# EAGLE design Magician_encoder (EAGLE 6.5.0)
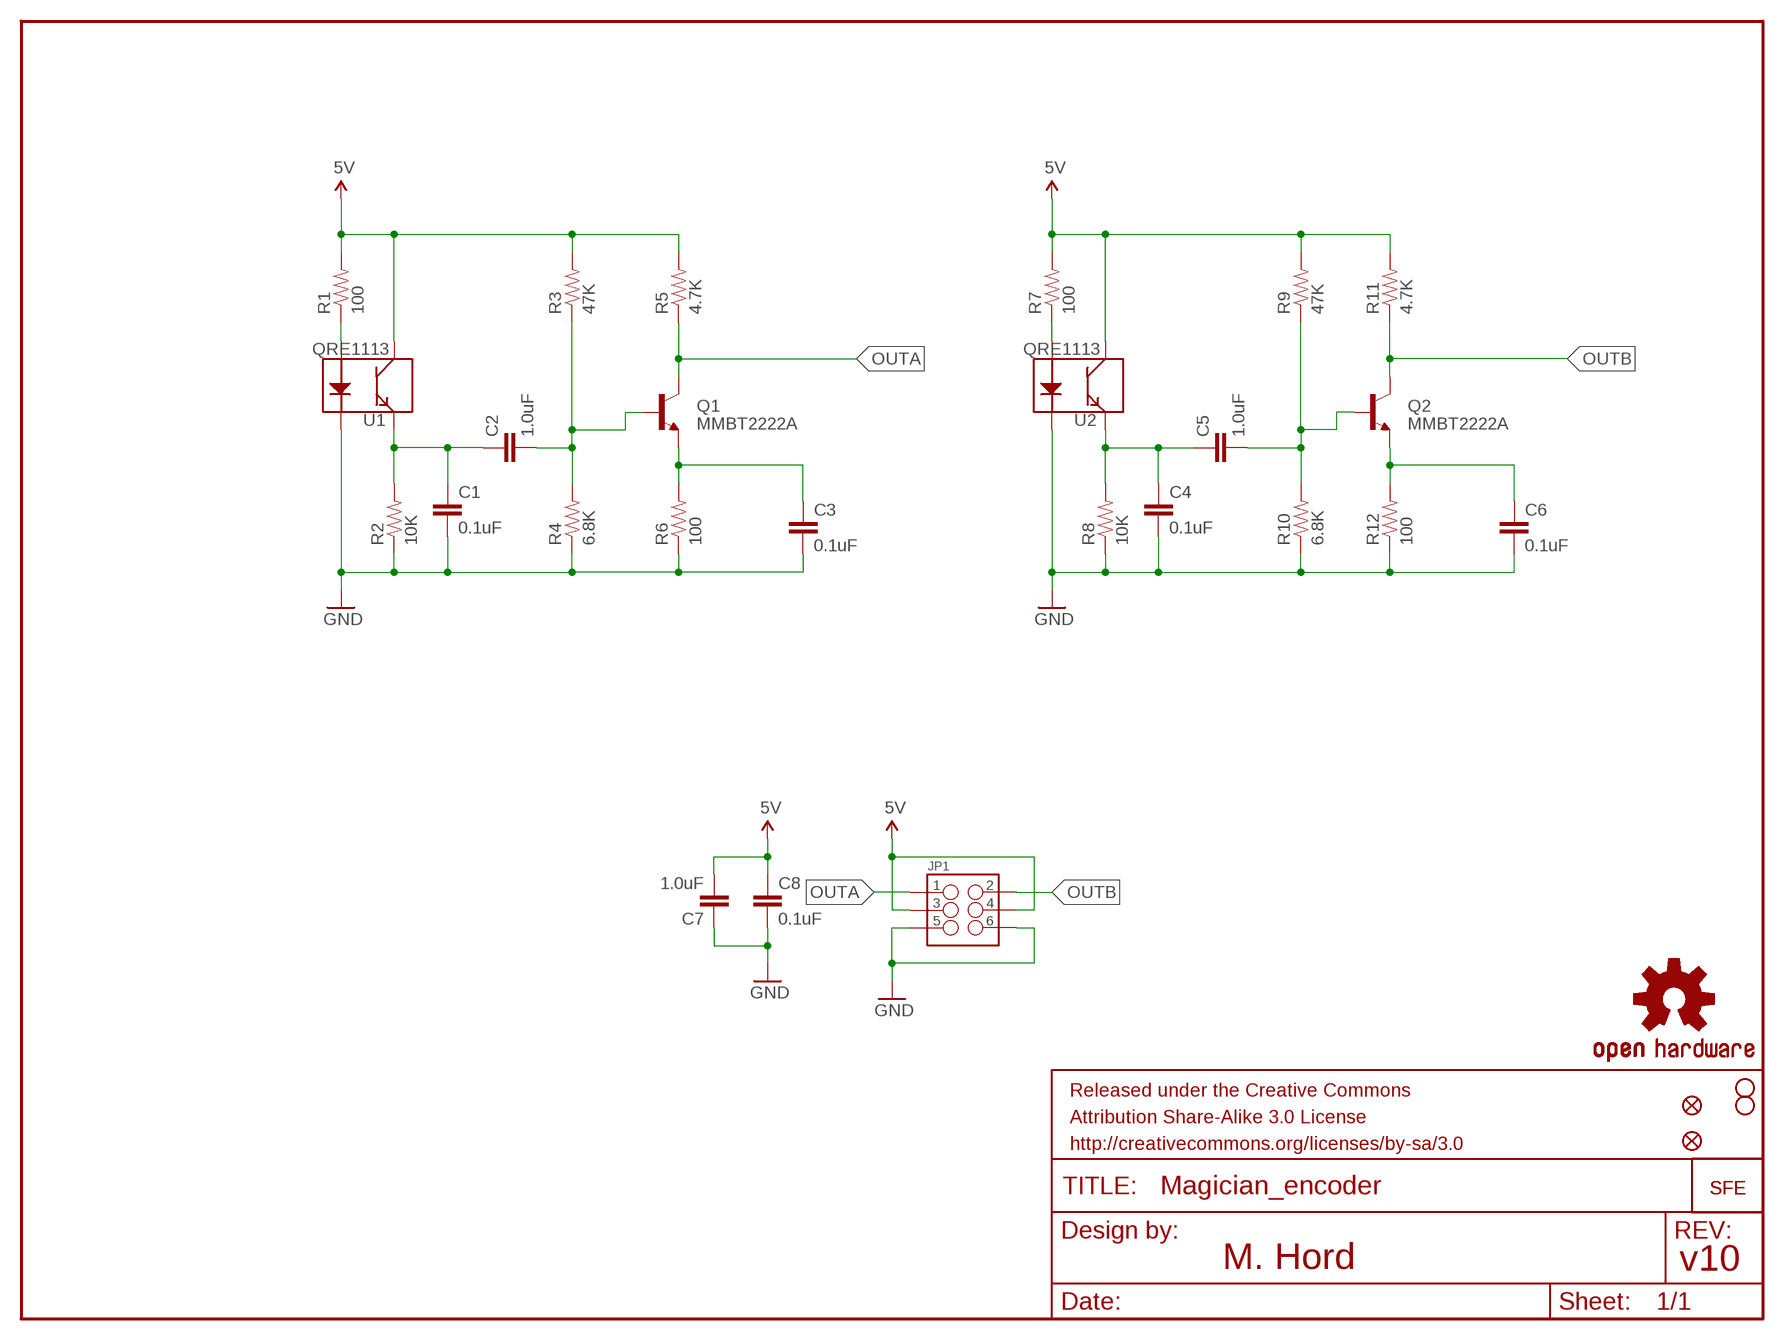
[diagram p0: schematic, sheet 1]

## Parts
C1  0.1uF  0.1UF-25V(+80/-20%)(0603)  [0603-CAP]
C2  1.0uF  1.0UF-16V-10%(0603)  [0603-CAP]
C3  0.1uF  0.1UF-25V(+80/-20%)(0603)  [0603-CAP]
C4  0.1uF  0.1UF-25V(+80/-20%)(0603)  [0603-CAP]
C5  1.0uF  1.0UF-16V-10%(0603)  [0603-CAP]
C6  0.1uF  0.1UF-25V(+80/-20%)(0603)  [0603-CAP]
C7  1.0uF  1.0UF-16V-10%(0603)  [0603-CAP]
C8  0.1uF  0.1UF-25V(+80/-20%)(0603)  [0603-CAP]
FID1  FIDUCIALUFIDUCIAL  [MICRO-FIDUCIAL]
FID2  FIDUCIALUFIDUCIAL  [MICRO-FIDUCIAL]
FRAME1  FRAME-LETTER  [CREATIVE_COMMONS]
JP1  M03X22X3_SILK_SM  [2X3]
LOGO1  LOGO-SFESK  [SFE-LOGO-FLAME]
LOGO3  OSHW-LOGOS  [OSHW-LOGO-S]
LOGO4  LOGO-SFENEW  [SFE-NEW-WEBLOGO]
Q1  MMBT2222A  TRANSISTOR_NPNMMBT2222A  [SOT23]
Q2  MMBT2222A  TRANSISTOR_NPNMMBT2222A  [SOT23]
R1  100  100OHM1/10W1%(0603)  [0603-RES]
R2  10K  10KOHM1/10W1%(0603)0603  [0603-RES]
R3  47K  47KOHM1/10W1%(0603)  [0603-RES]
R4  6.8K  10KOHM1/10W1%(0603)0603  [0603-RES]
R5  4.7K  10KOHM1/10W1%(0603)0603  [0603-RES]
R6  100  1KOHM1/10W1%(0603)  [0603-RES]
R7  100  100OHM1/10W1%(0603)  [0603-RES]
R8  10K  10KOHM1/10W1%(0603)0603  [0603-RES]
R9  47K  47KOHM1/10W1%(0603)  [0603-RES]
R10  6.8K  10KOHM1/10W1%(0603)0603  [0603-RES]
R11  4.7K  10KOHM1/10W1%(0603)0603  [0603-RES]
R12  100  1KOHM1/10W1%(0603)  [0603-RES]
STANDOFF1  STAND-OFF  [STAND-OFF]
STANDOFF2  STAND-OFF  [STAND-OFF]
U1  QRE1113  [QRE1113]
U2  QRE1113  [QRE1113]

## Nets
5V: C7.2 C8.1 JP1.3 JP1.4 R1.2 R3.2 R5.2 R7.2 R9.2 R11.2 U1.3(C) U2.3(C)
GND: C1.2 C3.2 C4.2 C6.2 C7.1 C8.2 JP1.5 JP1.6 R2.1 R4.1 R6.1 R8.1 R10.1 R12.1 U1.2(K) U2.2(K)
N$1: C1.1 C2.1 R2.2 U1.4(E)
N$2: C2.2 Q1.1(B) R3.1 R4.2
N$3: C3.1 Q1.2(E) R6.2
N$5: R1.1 U1.1(A)
N$7: C6.1 Q2.2(E) R12.2
N$8: C4.1 C5.1 R8.2 U2.4(E)
N$9: C5.2 Q2.1(B) R9.1 R10.2
N$10: R7.1 U2.1(A)
OUTA: JP1.1 Q1.3(C) R5.1
OUTB: JP1.2 Q2.3(C) R11.1

## Notes on the sheet
- M. Hord | v10

## Library data of the parts
C1 C3 C4 C6 C8 = SparkFun-Capacitors:0.1UF-25V(+80/-20%)(0603): Ceramic Standard decoupling cap CAP-00810; PROD_ID: CAP-00810
C2 C5 C7 = SparkFun-Capacitors:1.0UF-16V-10%(0603): CAP-00868; PROD_ID: CAP-00868
FID1 FID2 = SparkFun-Aesthetics:FIDUCIAL: Fiducial Alignment Points Various fiducial points for machine vision alignment.
FRAME1 = SparkFun-Aesthetics:FRAME-LETTER: Schematic Frame Standard 8.5x11 US Letter frame
JP1 = SparkFun-Connectors:M03X2: 2x3 .1" header. Shrouded, with keying- CONN-10681 SMT- CONN-11415 Pogo pins- HW-11044
LOGO1 LOGO4 = SparkFun-Aesthetics:LOGO-SFE: Spark Fun Electronics PCB Logo This is the standard Spark Fun Electronics PCB logo.
LOGO3 = SparkFun-Aesthetics:OSHW-LOGO: Open Source Hardware Logo This logo indicates the piece of hardware it is found on incorporates a OSHW license and/or adheres to the definition of open source hardware found here: http://freedomdefined.org/OSHW
Q1 Q2 = SparkFun-DiscreteSemi:TRANSISTOR_NPN: Generic NPN BJT MMBT2222A - TRANS-08049 (SOT-23, 1A 40V) MPSA42 - TRANS-09116 (SOT-23, 500mA 300V) MMBT5088LT1G - TRANS-11160 (SOT-23, 50 mA 30V); PROD_ID: TRANS-08049
R1 R7 = SparkFun-Resistors:100OHM1/10W1%(0603): RES-07863; PROD_ID: RES-07863
R2 R8 = SparkFun-Resistors:10KOHM1/10W1%(0603): RES-00824; PROD_ID: RES-00824
R3 R9 = SparkFun-Resistors:47KOHM1/10W1%(0603): RES-07871; PROD_ID: RES-07871
R4 R10 = SparkFun-Resistors:10KOHM1/10W1%(0603): RES-00824; PROD_ID: RES-08597; VALUE: 10K
R5 R11 = SparkFun-Resistors:10KOHM1/10W1%(0603): RES-00824; PROD_ID: RES-07857; VALUE: 10K
R6 R12 = SparkFun-Resistors:1KOHM1/10W1%(0603): RES-07856; PROD_ID: RES-07863; VALUE: 1K
STANDOFF1 STANDOFF2 = SparkFun-Electromechanical:STAND-OFF: #4 Stand Off This is the mechanical footprint for a #4 phillips button head screw. Use the keepout ring to avoid running the screw head into surrounding components. SKU : PRT-00447
U1 U2 = SparkFun-Sensors:QRE1113: Reflective object sensor; PROD_ID: IC-09357

## Board
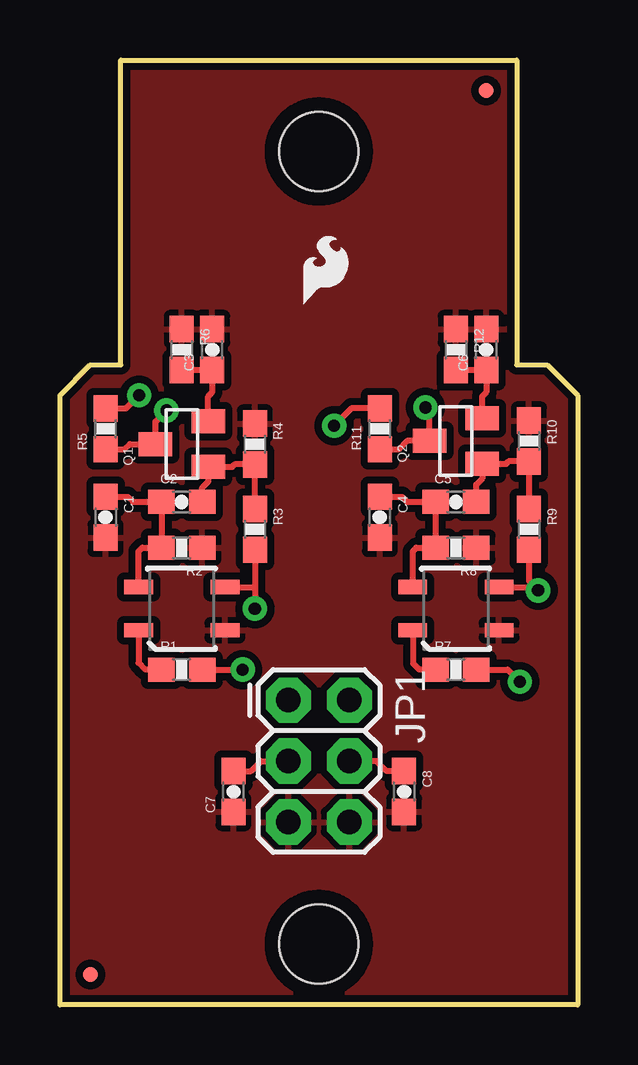
[diagram p1: board, top side]
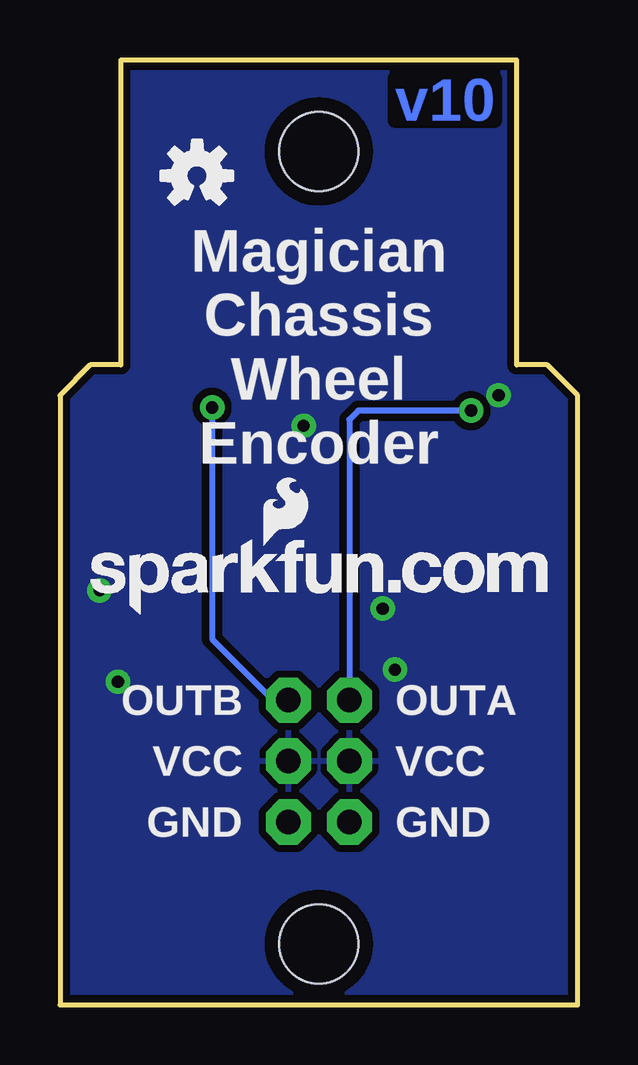
[diagram p2: board, bottom side, seen from below]

Size 21.59 x 39.37 mm. Coordinates in mm from the lower left corner, seen from the top.
Outline: 21.59,25.4 21.59,0 0,0 0,25.4 1.27,26.67 2.54,26.67 2.54,39.37 19.05,39.37 19.05,26.67 20.32,26.67 21.59,25.4
Copper layers (1*16): Top 0.035mm / dielectric 1.5mm / Bottom 0.035mm
Design rules "Sparkfun": minimum track width 8mil, minimum drill 20mil, track to track 8mil, track to pad 8mil, pad to pad 8mil, via to via 8mil, smd to smd 8mil, copper to edge 8mil, drill to drill 8mil, minimum pad ring 12mil, minimum via ring 10mil, stop-mask expansion 4mil, vias tented up to drill 20mil, thermal gap 10mil

### Footprints (pad centres in the part's own frame; a part is rotated, then mirrored left to right if it is on the bottom)
0603-CAP = smd 1.1 x 1: 1 -0.85,0; 2 0.85,0
MICRO-FIDUCIAL = smd 0.635 x 0.635: 1 0,0
2X3 = drill 1.016 pad 1.88 octagon: 1 0,0; 2 0,2.54; 3 2.54,0; 4 2.54,2.54; 5 5.08,0; 6 5.08,2.54
SOT23 = smd 1 x 1.4: 1 -0.95,-1.1; 2 0.95,-1.1; 3 0,1.1
0603-RES = smd 1.1 x 1: 1 -0.85,0; 2 0.85,0
STAND-OFF = hole 3.302: 0,0
QRE1113 = smd 1.2 x 0.6: 1 -1.8,-0.9; 2 1.8,-0.9; 3 1.8,0.9; 4 -1.8,0.9

### Placement (x,y rotation side)
C1  1.91,20.32 270 top
C2  5.08,20.95 0 top
C3  6.35,27.3 90 top
C4  13.34,20.32 270 top
C5  16.51,20.95 0 top
C6  17.78,27.3 90 top
C7  7.24,8.89 90 top
C8  14.35,8.89 270 top
FID1  17.78,38.1 0 top
FID2  1.27,1.27 0 top
FRAME1  -57.15,-10.16 0 top  (outside the outline)
JP1  9.53,12.7 270 top
LOGO1  10.16,29.21 0 top
LOGO3  15.88,34.54 0 bottom
LOGO4  20.32,16.26 0 bottom
Q1  5.08,23.37 90 top
Q2  16.51,23.5 90 top
R1  5.08,13.97 0 top
R2  5.08,19.05 180 top
R3  8.13,19.81 270 top
R4  8.13,23.37 270 top
R5  1.91,24 90 top
R6  5.08,27.3 270 top
R7  16.51,13.97 0 top
R8  16.51,19.05 180 top
R9  19.56,19.81 270 top
R10  19.56,23.5 270 top
R11  13.34,24 90 top
R12  16.51,27.3 270 top
STANDOFF1  10.79,2.54 0 top
STANDOFF2  10.79,35.56 0 top
U1  5.08,16.51 0 top
U2  16.51,16.51 0 top

### Tracks (layer width: path | path; a pad name or v marks a point on that pad's centre or on a via)
5V  (via drill 0.51)
  Top 0.254: R5.2 2.75,24.85 v3.3,25.4 | R1.2 v7.62,13.97 | R3.2 8.13,17.4 | 8.13,17.4 v8.13,16.51 | U1.3 8.12,17.41 8.13,17.4 | R11.2 12.15,24.85 v11.43,24.13 | R7.2 18.67,13.97 v19.18,13.46 | R9.2 19.56,17.65 v19.94,17.27 19.8,17.41 U2.3 | C7.2 7.96,9.74 8.38,10.16 JP1.3 | C8.1 13.63,9.74 13.21,10.16 JP1.4
  pour Bottom (isolate 0.305): 0,39.37 21.59,39.37 21.59,0 0,0
GND
  pour Top (isolate 0.305): 0,39.37 21.59,39.37 21.59,0 0,0
N$1
  Top 0.254: C1.1 2.83,21.17 3.05,20.95 C2.1 R2.2 3.43,19.05 3.28,18.9 U1.4
N$2
  Top 0.254: R3.1 R4.2 7.28,22.52 7.18,22.42 Q1.1 6.18,21.8 6.1,21.72 5.93,21.55 C2.2
N$3
  Top 0.254: R6.2 C3.1 6.35,25.53 6.29,25.46 6.22,25.4 6.18,25.36 Q1.2
N$5
  Top 0.254: R1.1 3.56,13.97 3.28,14.25 U1.1
N$7
  Top 0.254: R12.2 C6.1 17.78,25.53 17.61,25.36 Q2.2
N$8
  Top 0.254: C4.1 14.26,21.17 14.48,20.95 C5.1 R8.2 14.86,19.05 14.71,18.9 U2.4
N$9
  Top 0.254: R9.1 R10.2 18.71,22.64 18.61,22.55 Q2.1 17.61,21.93 17.36,21.68 C5.2 17.36,20.92 17.61,21.17
N$10
  Top 0.254: R7.1 14.99,13.97 14.73,14.22 14.73,15.59 U2.1
OUTA  (via drill 0.51)
  Top 0.254: R5.1 2.71,23.15 2.92,23.37 Q1.3 3.98,24.3 v4.45,24.77
  Bottom 0.254: v4.45,24.77 9.14,24.77 9.53,24.38 JP1.1
OUTB  (via drill 0.51)
  Top 0.254: R11.1 14.14,23.15 14.48,23.5 Q2.3 15.41,24.72 v15.24,24.89
  Bottom 0.254: v15.24,24.89 15.24,15.24 12.7,12.7 JP1.2

### Text on the board
Bottom: v10
bPlace: Magician / Chassis / Wheel / Encoder | OUTA | OUTB | VCC | VCC | GND | GND
tNames: M. Hord